# EAGLE design pentajoy_io (EAGLE 5.11)
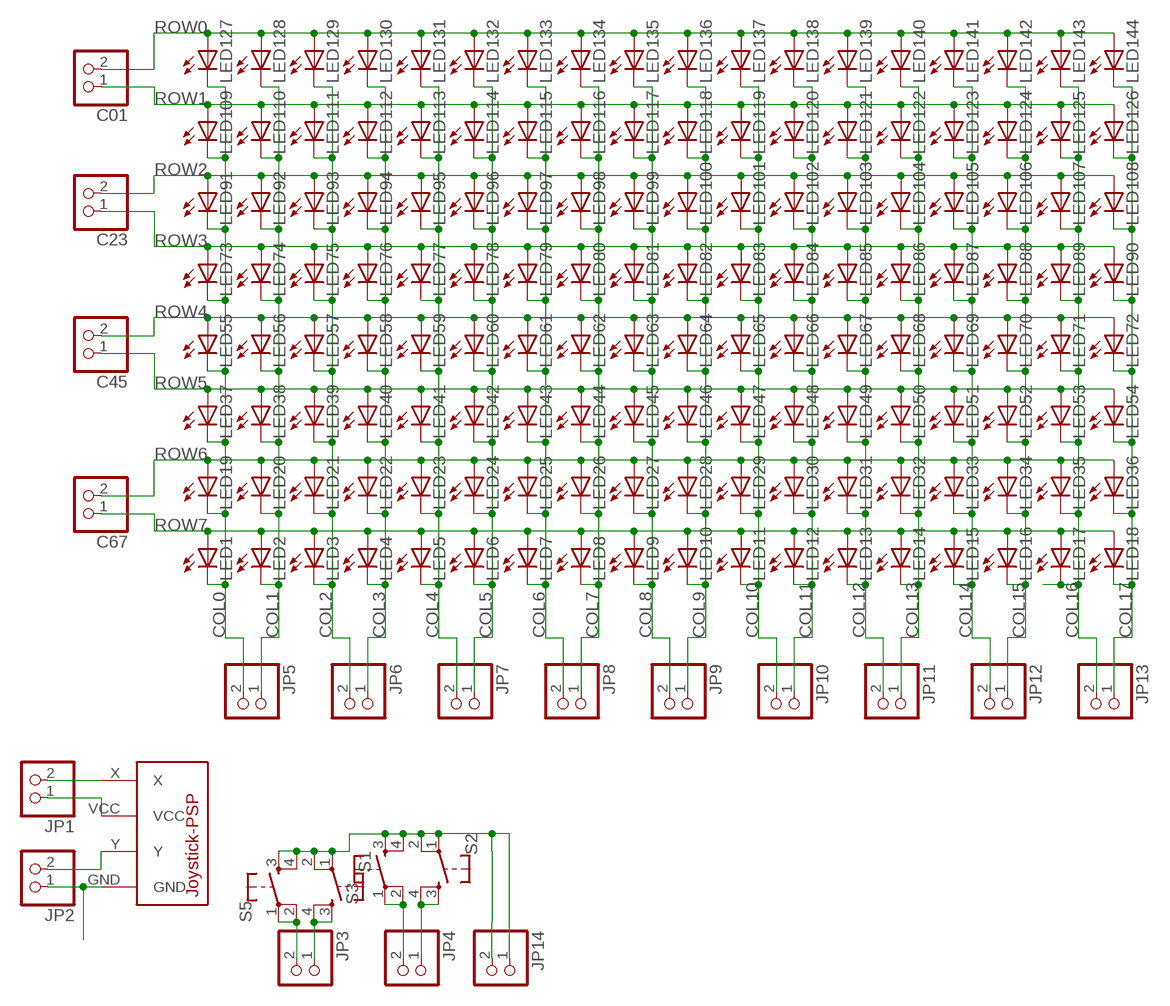
[diagram p0: schematic, sheet 1]

## Parts
C01  PINHD-1X02_2.54-SMD  [1X02SMD]
C23  PINHD-1X02_2.54-SMD  [1X02SMD]
C45  PINHD-1X02_2.54-SMD  [1X02SMD]
C67  PINHD-1X02_2.54-SMD  [1X02SMD]
JP1  PINHD-1X02_2.54-SMD  [1X02SMD]
JP2  PINHD-1X02_2.54-SMD  [1X02SMD]
JP3  PINHD-1X02_2.54-SMD  [1X02SMD]
JP4  PINHD-1X02_2.54-SMD  [1X02SMD]
JP5  PINHD-1X02_2.54-SMD  [1X02SMD]
JP6  PINHD-1X02_2.54-SMD  [1X02SMD]
JP7  PINHD-1X02_2.54-SMD  [1X02SMD]
JP8  PINHD-1X02_2.54-SMD  [1X02SMD]
JP9  PINHD-1X02_2.54-SMD  [1X02SMD]
JP10  PINHD-1X02_2.54-SMD  [1X02SMD]
JP11  PINHD-1X02_2.54-SMD  [1X02SMD]
JP12  PINHD-1X02_2.54-SMD  [1X02SMD]
JP13  PINHD-1X02_2.54-SMD  [1X02SMD]
JP14  PINHD-1X02_2.54-SMD  [1X02SMD]
LED1  LEDCHIPLED_0805  [CHIPLED_0805]
LED2  LEDCHIPLED_0805  [CHIPLED_0805]
LED3  LEDCHIPLED_0805  [CHIPLED_0805]
LED4  LEDCHIPLED_0805  [CHIPLED_0805]
LED5  LEDCHIPLED_0805  [CHIPLED_0805]
LED6  LEDCHIPLED_0805  [CHIPLED_0805]
LED7  LEDCHIPLED_0805  [CHIPLED_0805]
LED8  LEDCHIPLED_0805  [CHIPLED_0805]
LED9  LEDCHIPLED_0805  [CHIPLED_0805]
LED10  LEDCHIPLED_0805  [CHIPLED_0805]
LED11  LEDCHIPLED_0805  [CHIPLED_0805]
LED12  LEDCHIPLED_0805  [CHIPLED_0805]
LED13  LEDCHIPLED_0805  [CHIPLED_0805]
LED14  LEDCHIPLED_0805  [CHIPLED_0805]
LED15  LEDCHIPLED_0805  [CHIPLED_0805]
LED16  LEDCHIPLED_0805  [CHIPLED_0805]
LED17  LEDCHIPLED_0805  [CHIPLED_0805]
LED18  LEDCHIPLED_0805  [CHIPLED_0805]
LED19  LEDCHIPLED_0805  [CHIPLED_0805]
LED20  LEDCHIPLED_0805  [CHIPLED_0805]
LED21  LEDCHIPLED_0805  [CHIPLED_0805]
LED22  LEDCHIPLED_0805  [CHIPLED_0805]
LED23  LEDCHIPLED_0805  [CHIPLED_0805]
LED24  LEDCHIPLED_0805  [CHIPLED_0805]
LED25  LEDCHIPLED_0805  [CHIPLED_0805]
LED26  LEDCHIPLED_0805  [CHIPLED_0805]
LED27  LEDCHIPLED_0805  [CHIPLED_0805]
LED28  LEDCHIPLED_0805  [CHIPLED_0805]
LED29  LEDCHIPLED_0805  [CHIPLED_0805]
LED30  LEDCHIPLED_0805  [CHIPLED_0805]
LED31  LEDCHIPLED_0805  [CHIPLED_0805]
LED32  LEDCHIPLED_0805  [CHIPLED_0805]
LED33  LEDCHIPLED_0805  [CHIPLED_0805]
LED34  LEDCHIPLED_0805  [CHIPLED_0805]
LED35  LEDCHIPLED_0805  [CHIPLED_0805]
LED36  LEDCHIPLED_0805  [CHIPLED_0805]
LED37  LEDCHIPLED_0805  [CHIPLED_0805]
LED38  LEDCHIPLED_0805  [CHIPLED_0805]
LED39  LEDCHIPLED_0805  [CHIPLED_0805]
LED40  LEDCHIPLED_0805  [CHIPLED_0805]
LED41  LEDCHIPLED_0805  [CHIPLED_0805]
LED42  LEDCHIPLED_0805  [CHIPLED_0805]
LED43  LEDCHIPLED_0805  [CHIPLED_0805]
LED44  LEDCHIPLED_0805  [CHIPLED_0805]
LED45  LEDCHIPLED_0805  [CHIPLED_0805]
LED46  LEDCHIPLED_0805  [CHIPLED_0805]
LED47  LEDCHIPLED_0805  [CHIPLED_0805]
LED48  LEDCHIPLED_0805  [CHIPLED_0805]
LED49  LEDCHIPLED_0805  [CHIPLED_0805]
LED50  LEDCHIPLED_0805  [CHIPLED_0805]
LED51  LEDCHIPLED_0805  [CHIPLED_0805]
LED52  LEDCHIPLED_0805  [CHIPLED_0805]
LED53  LEDCHIPLED_0805  [CHIPLED_0805]
LED54  LEDCHIPLED_0805  [CHIPLED_0805]
LED55  LEDCHIPLED_0805  [CHIPLED_0805]
LED56  LEDCHIPLED_0805  [CHIPLED_0805]
LED57  LEDCHIPLED_0805  [CHIPLED_0805]
LED58  LEDCHIPLED_0805  [CHIPLED_0805]
LED59  LEDCHIPLED_0805  [CHIPLED_0805]
LED60  LEDCHIPLED_0805  [CHIPLED_0805]
LED61  LEDCHIPLED_0805  [CHIPLED_0805]
LED62  LEDCHIPLED_0805  [CHIPLED_0805]
LED63  LEDCHIPLED_0805  [CHIPLED_0805]
LED64  LEDCHIPLED_0805  [CHIPLED_0805]
LED65  LEDCHIPLED_0805  [CHIPLED_0805]
LED66  LEDCHIPLED_0805  [CHIPLED_0805]
LED67  LEDCHIPLED_0805  [CHIPLED_0805]
LED68  LEDCHIPLED_0805  [CHIPLED_0805]
LED69  LEDCHIPLED_0805  [CHIPLED_0805]
LED70  LEDCHIPLED_0805  [CHIPLED_0805]
LED71  LEDCHIPLED_0805  [CHIPLED_0805]
LED72  LEDCHIPLED_0805  [CHIPLED_0805]
LED73  LEDCHIPLED_0805  [CHIPLED_0805]
LED74  LEDCHIPLED_0805  [CHIPLED_0805]
LED75  LEDCHIPLED_0805  [CHIPLED_0805]
LED76  LEDCHIPLED_0805  [CHIPLED_0805]
LED77  LEDCHIPLED_0805  [CHIPLED_0805]
LED78  LEDCHIPLED_0805  [CHIPLED_0805]
LED79  LEDCHIPLED_0805  [CHIPLED_0805]
LED80  LEDCHIPLED_0805  [CHIPLED_0805]
LED81  LEDCHIPLED_0805  [CHIPLED_0805]
LED82  LEDCHIPLED_0805  [CHIPLED_0805]
LED83  LEDCHIPLED_0805  [CHIPLED_0805]
LED84  LEDCHIPLED_0805  [CHIPLED_0805]
LED85  LEDCHIPLED_0805  [CHIPLED_0805]
LED86  LEDCHIPLED_0805  [CHIPLED_0805]
LED87  LEDCHIPLED_0805  [CHIPLED_0805]
LED88  LEDCHIPLED_0805  [CHIPLED_0805]
LED89  LEDCHIPLED_0805  [CHIPLED_0805]
LED90  LEDCHIPLED_0805  [CHIPLED_0805]
LED91  LEDCHIPLED_0805  [CHIPLED_0805]
LED92  LEDCHIPLED_0805  [CHIPLED_0805]
LED93  LEDCHIPLED_0805  [CHIPLED_0805]
LED94  LEDCHIPLED_0805  [CHIPLED_0805]
LED95  LEDCHIPLED_0805  [CHIPLED_0805]
LED96  LEDCHIPLED_0805  [CHIPLED_0805]
LED97  LEDCHIPLED_0805  [CHIPLED_0805]
LED98  LEDCHIPLED_0805  [CHIPLED_0805]
LED99  LEDCHIPLED_0805  [CHIPLED_0805]
LED100  LEDCHIPLED_0805  [CHIPLED_0805]
LED101  LEDCHIPLED_0805  [CHIPLED_0805]
LED102  LEDCHIPLED_0805  [CHIPLED_0805]
LED103  LEDCHIPLED_0805  [CHIPLED_0805]
LED104  LEDCHIPLED_0805  [CHIPLED_0805]
LED105  LEDCHIPLED_0805  [CHIPLED_0805]
LED106  LEDCHIPLED_0805  [CHIPLED_0805]
LED107  LEDCHIPLED_0805  [CHIPLED_0805]
LED108  LEDCHIPLED_0805  [CHIPLED_0805]
LED109  LEDCHIPLED_0805  [CHIPLED_0805]
LED110  LEDCHIPLED_0805  [CHIPLED_0805]
LED111  LEDCHIPLED_0805  [CHIPLED_0805]
LED112  LEDCHIPLED_0805  [CHIPLED_0805]
LED113  LEDCHIPLED_0805  [CHIPLED_0805]
LED114  LEDCHIPLED_0805  [CHIPLED_0805]
LED115  LEDCHIPLED_0805  [CHIPLED_0805]
LED116  LEDCHIPLED_0805  [CHIPLED_0805]
LED117  LEDCHIPLED_0805  [CHIPLED_0805]
LED118  LEDCHIPLED_0805  [CHIPLED_0805]
LED119  LEDCHIPLED_0805  [CHIPLED_0805]
LED120  LEDCHIPLED_0805  [CHIPLED_0805]
LED121  LEDCHIPLED_0805  [CHIPLED_0805]
LED122  LEDCHIPLED_0805  [CHIPLED_0805]
LED123  LEDCHIPLED_0805  [CHIPLED_0805]
LED124  LEDCHIPLED_0805  [CHIPLED_0805]
LED125  LEDCHIPLED_0805  [CHIPLED_0805]
LED126  LEDCHIPLED_0805  [CHIPLED_0805]
LED127  LEDCHIPLED_0805  [CHIPLED_0805]
LED128  LEDCHIPLED_0805  [CHIPLED_0805]
LED129  LEDCHIPLED_0805  [CHIPLED_0805]
LED130  LEDCHIPLED_0805  [CHIPLED_0805]
LED131  LEDCHIPLED_0805  [CHIPLED_0805]
LED132  LEDCHIPLED_0805  [CHIPLED_0805]
LED133  LEDCHIPLED_0805  [CHIPLED_0805]
LED134  LEDCHIPLED_0805  [CHIPLED_0805]
LED135  LEDCHIPLED_0805  [CHIPLED_0805]
LED136  LEDCHIPLED_0805  [CHIPLED_0805]
LED137  LEDCHIPLED_0805  [CHIPLED_0805]
LED138  LEDCHIPLED_0805  [CHIPLED_0805]
LED139  LEDCHIPLED_0805  [CHIPLED_0805]
LED140  LEDCHIPLED_0805  [CHIPLED_0805]
LED141  LEDCHIPLED_0805  [CHIPLED_0805]
LED142  LEDCHIPLED_0805  [CHIPLED_0805]
LED143  LEDCHIPLED_0805  [CHIPLED_0805]
LED144  LEDCHIPLED_0805  [CHIPLED_0805]
S1  TAC_SWITCHPTH  [TACTILE-PTH]
S2  TAC_SWITCHPTH  [TACTILE-PTH]
S3  TAC_SWITCHPTH  [TACTILE-PTH]
S5  TAC_SWITCHPTH  [TACTILE-PTH]
U$1  JOYSTICK-PSP1000  [JOYSTICK-PSP1000]

## Nets
COL0: JP5.2 LED1.C LED19.C LED37.C LED55.C LED73.C LED91.C LED109.C LED127.C
COL1: JP5.1 LED2.C LED20.C LED38.C LED56.C LED74.C LED92.C LED110.C LED128.C
COL2: JP6.2 LED3.C LED21.C LED39.C LED57.C LED75.C LED93.C LED111.C LED129.C
COL3: JP6.1 LED4.C LED22.C LED40.C LED58.C LED76.C LED94.C LED112.C LED130.C
COL4: JP7.2 LED5.C LED23.C LED41.C LED59.C LED77.C LED95.C LED113.C LED131.C
COL5: JP7.1 LED6.C LED24.C LED42.C LED60.C LED78.C LED96.C LED114.C LED132.C
COL6: JP8.2 LED7.C LED25.C LED43.C LED61.C LED79.C LED97.C LED115.C LED133.C
COL7: JP8.1 LED8.C LED26.C LED44.C LED62.C LED80.C LED98.C LED116.C LED134.C
COL8: JP9.2 LED9.C LED27.C LED45.C LED63.C LED81.C LED99.C LED117.C LED135.C
COL9: JP9.1 LED10.C LED28.C LED46.C LED64.C LED82.C LED100.C LED118.C LED136.C
COL10: JP10.2 LED11.C LED29.C LED47.C LED65.C LED83.C LED101.C LED119.C LED137.C
COL11: JP10.1 LED12.C LED30.C LED48.C LED66.C LED84.C LED102.C LED120.C LED138.C
COL12: JP11.2 LED13.C LED31.C LED49.C LED67.C LED85.C LED103.C LED121.C LED139.C
COL13: JP11.1 LED14.C LED32.C LED50.C LED68.C LED86.C LED104.C LED122.C LED140.C
COL14: JP12.2 LED15.C LED33.C LED51.C LED69.C LED87.C LED105.C LED123.C LED141.C
COL15: JP12.1 LED16.C LED34.C LED52.C LED70.C LED88.C LED106.C LED124.C LED142.C
COL16: JP13.2 LED17.C LED35.C LED53.C LED71.C LED89.C LED107.C LED125.C LED143.C
COL17: JP13.1 LED18.C LED36.C LED54.C LED72.C LED90.C LED108.C LED126.C LED144.C
GND: JP2.1 JP14.1 JP14.2 S1.1 S1.2 S2.1 S2.2 S3.3 S3.4 S5.3 S5.4 U$1.GND
N$1: JP4.1 S2.3 S2.4
N$2: JP4.2 S3.1 S3.2
N$3: JP3.1 S1.3 S1.4
N$4: JP3.2 S5.1 S5.2
N$6: JP2.2 U$1.Y
N$7: JP1.1 U$1.VCC
N$8: JP1.2 U$1.X
ROW0: C01.2 LED127.A LED128.A LED129.A LED130.A LED131.A LED132.A LED133.A LED134.A LED135.A LED136.A LED137.A LED138.A LED139.A LED140.A LED141.A LED142.A LED143.A LED144.A
ROW1: C01.1 LED109.A LED110.A LED111.A LED112.A LED113.A LED114.A LED115.A LED116.A LED117.A LED118.A LED119.A LED120.A LED121.A LED122.A LED123.A LED124.A LED125.A LED126.A
ROW2: C23.2 LED91.A LED92.A LED93.A LED94.A LED95.A LED96.A LED97.A LED98.A LED99.A LED100.A LED101.A LED102.A LED103.A LED104.A LED105.A LED106.A LED107.A LED108.A
ROW3: C23.1 LED73.A LED74.A LED75.A LED76.A LED77.A LED78.A LED79.A LED80.A LED81.A LED82.A LED83.A LED84.A LED85.A LED86.A LED87.A LED88.A LED89.A LED90.A
ROW4: C45.2 LED55.A LED56.A LED57.A LED58.A LED59.A LED60.A LED61.A LED62.A LED63.A LED64.A LED65.A LED66.A LED67.A LED68.A LED69.A LED70.A LED71.A LED72.A
ROW5: C45.1 LED37.A LED38.A LED39.A LED40.A LED41.A LED42.A LED43.A LED44.A LED45.A LED46.A LED47.A LED48.A LED49.A LED50.A LED51.A LED52.A LED53.A LED54.A
ROW6: C67.2 LED19.A LED20.A LED21.A LED22.A LED23.A LED24.A LED25.A LED26.A LED27.A LED28.A LED29.A LED30.A LED31.A LED32.A LED33.A LED34.A LED35.A LED36.A
ROW7: C67.1 LED1.A LED2.A LED3.A LED4.A LED5.A LED6.A LED7.A LED8.A LED9.A LED10.A LED11.A LED12.A LED13.A LED14.A LED15.A LED16.A LED17.A LED18.A

## Library data of the parts
C01 C23 C45 C67 JP1-JP14 = pinhead-2:PINHD-1X02: PIN HEADER
LED1-LED144 = led:LED: LED OSRAM: - CHIPLED LG R971, LG N971, LY N971, LG Q971, LY Q971, LO R971, LY R971 LH N974, LH R974 LS Q976, LO Q976, LY Q976 LO Q996 - Hyper CHIPLED LW Q18S LB Q993, LB Q99A, LB R99A - SideLED LS A670, LO A670, LY A670, LG A670, LP A670 LB A673, LV A673, LT A673, LW A673 LH A674 LY A675 LS A676, LA A676, LO A676, LY A676, LW A676 LS A679, LY A679, LG A679 - Hyper Micro SIDELED® LS Y876, LA Y876, LO Y876, LY Y876 LT Y87S - SmartLED LW L88C, LW L88S LB L89C, LB L89S, LG L890 LS L89K, LO L89K, LY L89K LS L896, LA L896, LO L896, LY L896 - TOPLED LS T670, LO T670, LY T670, LG T670, LP T670 LSG T670, LSP T670, LSY T670, LOP T670, LYG T670 LG T671, LOG T671, LSG T671 LB T673, LV T673, LT T673, LW T673 LH T674 LS T676, LA T676, LO T676, LY T676, LB T676, LH T676, LSB T676, LW T676 LB T67C, LV T67C, LT T67C, LS T67K, LO T67K, LY T67K, LW E67C LS E67B, LA E67B, LO E67B, LY E67B, LB E67C, LV E67C, LT E67C LW T67C LS T679, LY T679, LG T679 LS T770, LO T770, LY T770, LG T770, LP T770 LB T773, LV T773, LT T773, LW T773 LH T774 LS E675, LA E675, LY E675, LS T675 LS T776, LA T776, LO T776, LY T776, LB T776 LHGB T686 LT T68C, LB T68C - Hyper Mini TOPLED® LB M676 - Mini TOPLED Santana® LG M470 LS M47K, LO M47K, LY M47K Source: http://www.osram.convergy.de LUXEON: - LUMILED® LXK2-PW12-R00, LXK2-PW12-S00, LXK2-PW14-U00, LXK2-PW14-V00 LXK2-PM12-R00, LXK2-PM12-S00, LXK2-PM14-U00 LXK2-PE12-Q00, LXK2-PE12-R00, LXK2-PE12-S00, LXK2-PE14-T00, LXK2-PE14-U00 LXK2-PB12-K00, LXK2-PB12-L00, LXK2-PB12-M00, LXK2-PB14-N00, LXK2-PB14-P00, LXK2-PB14-Q00 LXK2-PR12-L00, LXK2-PR12-M00, LXK2-PR14-Q00, LXK2-PR14-R00 LXK2-PD12-Q00, LXK2-PD12-R00, LXK2-PD12-S00 LXK2-PH12-R00, LXK2-PH12-S00 LXK2-PL12-P00, LXK2-PL12-Q00, LXK2-PL12-R00 Source: www.luxeon.com KINGBRIGHT: KA-3528ASYC Source: www.kingbright.com
S1-S3 S5 = SparkFun:TAC_SWITCH: Momentary Switch Button commonly used for reset or general input. Spark Fun Electronics SKU : COM-00097
U$1 = SparkFun:JOYSTICK-PSP1000: This is a footprint for the PSP-1000 Joystick. 4-pins: X, Y, Vcc and GND

## Board
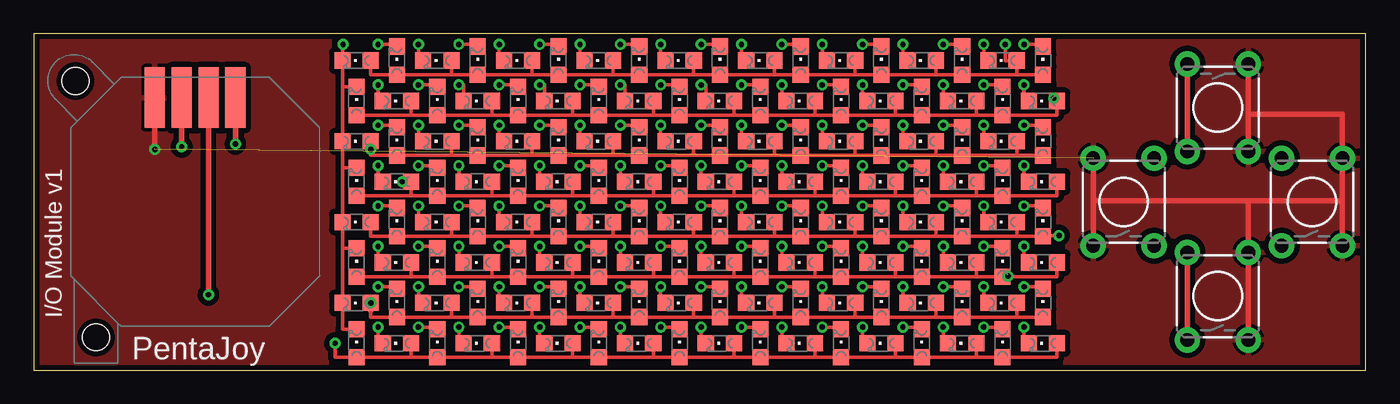
[diagram p1: board, top side]
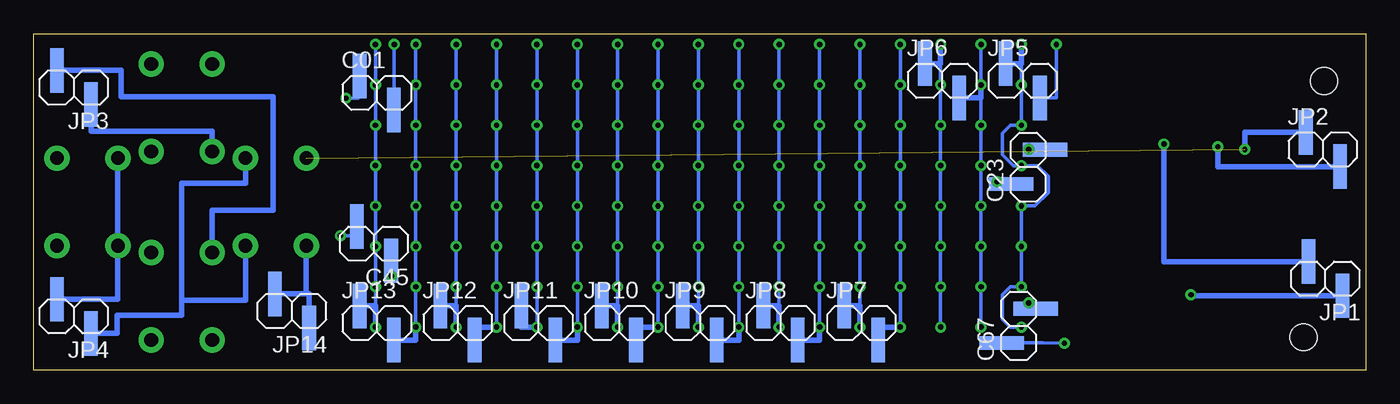
[diagram p2: board, bottom side, seen from below]

Size 99 x 25 mm. Coordinates in mm from the lower left corner, seen from the top.
Outline: 99,25 0,25 0,0 99,0 99,25
Copper layers (1+2*3+16): Top 0.035mm / dielectric 1.5mm / Route2 0.035mm / dielectric 0.15mm / Route3 0.035mm / dielectric 0.2mm / Bottom 0.035mm
Design rules "default *": minimum track width 10mil, minimum drill 0.4mm, track to track 8mil, track to pad 8mil, pad to pad 8mil, via to via 8mil, smd to smd 8mil, copper to edge 15mil, drill to drill 8mil, minimum pad ring 10mil, minimum via ring 8mil, stop-mask expansion 4mil, vias tented up to drill 190mil, thermal gap 10mil

### Footprints (pad centres in the part's own frame; a part is rotated, then mirrored left to right if it is on the bottom)
1X02SMD = smd 1.016 x 3.302: 1 -1.27,1.27; 2 1.27,-1.27
CHIPLED_0805 = smd 1.2 x 1.2: A 0,-1.05; C 0,1.05
TACTILE-PTH = drill 1.016 pad 1.88 round: 1 -3.251,2.261; 2 3.251,2.261; 3 -3.251,-2.261; 4 3.251,-2.261
JOYSTICK-PSP1000 = smd 1.5 x 4.5: GND -3,7.75; VCC 1,7.75; X 3,7.75; Y -1,7.75 | hole 2: -8.89,8.985; -7.375,-10.06

### Placement (x,y rotation side)
C01  73.5,20.6 0 bottom
C23  25.1,15.1 90 bottom
C45  73.7,9.4 180 bottom
C67  25.8,3.3 90 bottom
JP1  3,6.8 180 bottom
JP2  3.2,16.4 0 bottom
JP3  96,21 180 bottom
JP4  96,4 180 bottom
JP5  25.5,21.5 0 bottom
JP6  31.5,21.5 0 bottom
JP7  37.5,3.5 0 bottom
JP8  43.5,3.5 0 bottom
JP9  49.5,3.5 0 bottom
JP10  55.5,3.5 0 bottom
JP11  61.5,3.5 0 bottom
JP12  67.5,3.5 0 bottom
JP13  73.5,3.5 0 bottom
JP14  79.8,4.4 180 bottom
LED1  24,2 0 top
LED2  27,2 90 top
LED3  30,2 0 top
LED4  33,2 90 top
LED5  36,2 0 top
LED6  39,2 90 top
LED7  42,2 0 top
LED8  45,2 90 top
LED9  48,2 0 top
LED10  51,2 90 top
LED11  54,2 0 top
LED12  57,2 90 top
LED13  60,2 0 top
LED14  63,2 90 top
LED15  66,2 0 top
LED16  69,2 90 top
LED17  72,2 0 top
LED18  75,2 90 top
LED19  24,5 90 top
LED20  27,5 0 top
LED21  30,5 90 top
LED22  33,5 0 top
LED23  36,5 90 top
LED24  39,5 0 top
LED25  42,5 90 top
LED26  45,5 0 top
LED27  48,5 90 top
LED28  51,5 0 top
LED29  54,5 90 top
LED30  57,5 0 top
LED31  60,5 90 top
LED32  63,5 0 top
LED33  66,5 90 top
LED34  69,5 0 top
LED35  72,5 90 top
LED36  75,5 0 top
LED37  24,8 0 top
LED38  27,8 90 top
LED39  30,8 0 top
LED40  33,8 90 top
LED41  36,8 0 top
LED42  39,8 90 top
LED43  42,8 0 top
LED44  45,8 90 top
LED45  48,8 0 top
LED46  51,8 90 top
LED47  54,8 0 top
LED48  57,8 90 top
LED49  60,8 0 top
LED50  63,8 90 top
LED51  66,8 0 top
LED52  69,8 90 top
LED53  72,8 0 top
LED54  75,8 90 top
LED55  24,11 90 top
LED56  27,11 0 top
LED57  30,11 90 top
LED58  33,11 0 top
LED59  36,11 90 top
LED60  39,11 0 top
LED61  42,11 90 top
LED62  45,11 0 top
LED63  48,11 90 top
LED64  51,11 0 top
LED65  54,11 90 top
LED66  57,11 0 top
LED67  60,11 90 top
LED68  63,11 0 top
LED69  66,11 90 top
LED70  69,11 0 top
LED71  72,11 90 top
LED72  75,11 0 top
LED73  24,14 0 top
LED74  27,14 90 top
LED75  30,14 0 top
LED76  33,14 90 top
LED77  36,14 0 top
LED78  39,14 90 top
LED79  42,14 0 top
LED80  45,14 90 top
LED81  48,14 0 top
LED82  51,14 90 top
LED83  54,14 0 top
LED84  57,14 90 top
LED85  60,14 0 top
LED86  63,14 90 top
LED87  66,14 0 top
LED88  69,14 90 top
LED89  72,14 0 top
LED90  75,14 90 top
LED91  24,17 90 top
LED92  27,17 0 top
LED93  30,17 90 top
LED94  33,17 0 top
LED95  36,17 90 top
LED96  39,17 0 top
LED97  42,17 90 top
LED98  45,17 0 top
LED99  48,17 90 top
LED100  51,17 0 top
LED101  54,17 90 top
LED102  57,17 0 top
LED103  60,17 90 top
LED104  63,17 0 top
LED105  66,17 90 top
LED106  69,17 0 top
LED107  72,17 90 top
LED108  75,17 0 top
LED109  24,20 0 top
LED110  27,20 90 top
LED111  30,20 0 top
LED112  33,20 90 top
LED113  36,20 0 top
LED114  39,20 90 top
LED115  42,20 0 top
LED116  45,20 90 top
LED117  48,20 0 top
LED118  51,20 90 top
LED119  54,20 0 top
LED120  57,20 90 top
LED121  60,20 0 top
LED122  63,20 90 top
LED123  66,20 0 top
LED124  69,20 90 top
LED125  72,20 0 top
LED126  75,20 90 top
LED127  24,23 90 top
LED128  27,23 0 top
LED129  30,23 90 top
LED130  33,23 0 top
LED131  36,23 90 top
LED132  39,23 0 top
LED133  42,23 90 top
LED134  45,23 0 top
LED135  48,23 90 top
LED136  51,23 0 top
LED137  54,23 90 top
LED138  57,23 0 top
LED139  60,23 90 top
LED140  63,23 0 top
LED141  66,23 90 top
LED142  69,23 0 top
LED143  72,23 90 top
LED144  75,23 0 top
S1  88,19.5 270 top
S2  81,12.5 90 top
S3  95,12.5 90 top
S5  88,5.5 90 top
U$1  12,12.5 0 top

### Tracks (layer width: path | path; a pad name or v marks a point on that pad's centre or on a via)
COL0  (via drill 0.4)
  Top 0.254: LED1.C 22.95,3.05 LED19.C 22.95,9.05 | 22.95,9.05 LED37.C | 22.95,9.05 LED55.C 22.95,15 | 22.95,15 LED91.C 22.95,21 | 22.95,21 LED127.C 22.95,24.2 v23,24.2 | LED73.C 22.95,15.05 22.95,15 | LED109.C 22.95,21.05 22.95,21
  Bottom 0.254: JP5.2 23,20.23 v23,24.2
COL1  (via drill 0.4)
  Top 0.254: LED2.C 25.6,2 v25.6,3.2 | v25.6,9.2 25.6,8 LED38.C | LED20.C 27,6.2 v25.6,6.2 | v25.6,24.2 27,24.2 LED128.C | LED56.C 27,12.2 v25.6,12.2 | LED74.C 25.6,14 v25.6,15.2 | LED92.C 27,18.2 v25.6,18.2 | LED110.C 25.6,20 v25.6,21.2
  Bottom 0.254: v25.6,6.2 25.6,6.8 | 25.6,6.8 v25.6,9.2 v25.6,12.2 24.6,12.2 23.6,13.2 23.6,14.4 24.4,15.2 v25.6,15.2 26.2,15.2 27,16 27,17.6 26.4,18.2 v25.6,18.2 v25.6,21.2 | v25.6,6.2 25.6,6.8 | v25.6,21.2 25.6,21.4 | 25.6,21.4 v25.6,24.2 | v25.6,21.2 25.6,21.4 | v25.6,3.2 26.4,3.2 27,3.8 27,5.6 26.4,6.2 v25.6,6.2
  Bottom 0.406: JP5.1 25.6,22.77 v25.6,24.2
COL2  (via drill 0.4)
  Top 0.254: LED3.C 30,3.2 v28.6,3.2 | v28.6,24.2 28.6,23 LED129.C | v28.6,21.2 30,21.2 LED111.C | LED93.C 28.6,17 v28.6,18.2 | LED57.C 28.6,11 v28.6,12.2 | v28.6,15.2 30,15.2 LED75.C | v28.6,9.2 30,9.2 LED39.C | LED21.C 28.6,5 v28.6,6.2
  Bottom 0.254: v28.6,24.2 v28.6,21.2 v28.6,18.2 v28.6,15.2 v28.6,12.2 v28.6,9.2 v28.6,6.2 v28.6,3.2
  Bottom 0.406: JP6.2 28.6,20.23 v28.6,21.2
COL3  (via drill 0.4)
  Top 0.254: LED4.C 31.6,2 v31.6,3.2 | v31.6,24.2 33,24.2 LED130.C | v31.6,21.2 31.95,21.2 LED112.C | v31.6,18.2 33,18.2 LED94.C | v31.6,6.2 33,6.2 LED22.C | v31.6,12.2 33,12.2 LED58.C | LED40.C 31.6,8 v31.6,9.2 | LED76.C 31.6,14 v31.6,15.2
  Bottom 0.254: v31.6,24.2 v31.6,21.2 v31.6,18.2 v31.6,15.2 v31.6,12.2 v31.6,9.2 v31.6,6.2 v31.6,3.2
  Bottom 0.406: JP6.1 31.6,22.77 v31.6,24.2
COL4  (via drill 0.4)
  Top 0.254: LED5.C 36,3.2 v34.6,3.2 | v34.6,24.2 34.6,23 LED131.C | v34.6,21.2 36,21.2 LED113.C | v34.6,15.2 36,15.2 LED77.C | v34.6,9.2 36,9.2 LED41.C | LED95.C 34.6,17 v34.6,18.2 | LED23.C 34.6,5 v34.6,6.2 | LED59.C 34.6,11 v34.6,12.2
  Bottom 0.254: v34.6,24.2 v34.6,21.2 v34.6,18.2 v34.6,15.2 v34.6,12.2 v34.6,9.2 v34.6,6.2 v34.6,3.2
  Bottom 0.406: v34.6,3.2 36.23,3.2 JP7.2
COL5  (via drill 0.4)
  Top 0.254: LED6.C 37.6,2 v37.6,3.2 | v37.6,24.2 39,24.2 LED132.C | v37.6,21.2 37.95,21.2 LED114.C | v37.6,18.2 39,18.2 LED96.C | v37.6,12.2 39,12.2 LED60.C | v37.6,6.2 39,6.2 LED24.C | LED78.C 37.6,14 v37.6,15.2 | LED42.C 37.6,8 v37.6,9.2
  Bottom 0.254: v37.6,24.2 v37.6,21.2 v37.6,18.2 v37.6,15.2 v37.6,12.2 v37.6,9.2 v37.6,6.2 v37.6,3.2
  Bottom 0.406: JP7.1 37.6,4.77 v37.6,3.2
COL6  (via drill 0.4)
  Top 0.254: LED7.C 42,3.2 v40.6,3.2 | v40.6,24.2 40.6,23 LED133.C | v40.6,21.2 42,21.2 LED115.C | LED97.C 40.6,17 v40.6,18.2 | v40.6,15.2 42,15.2 LED79.C | LED25.C 40.6,5 v40.6,6.2 | v40.6,9.2 42,9.2 LED43.C | LED61.C 40.6,11 v40.6,12.2
  Bottom 0.254: v40.6,24.2 v40.6,21.2 v40.6,18.2 v40.6,15.2 v40.6,12.2 v40.6,9.2 v40.6,6.2 v40.6,3.2
  Bottom 0.406: JP8.2 40.6,2.23 v40.6,3.2
COL7  (via drill 0.4)
  Top 0.254: LED8.C 43.6,2 v43.6,3.2 | v43.6,24.2 45,24.2 LED134.C | v43.6,21.2 43.95,21.2 LED116.C | v43.6,18.2 45,18.2 LED98.C | v43.6,12.2 45,12.2 LED62.C | v43.6,6.2 45,6.2 LED26.C | LED44.C 43.6,8 v43.6,9.2 | LED80.C 43.6,14 v43.6,15.2
  Bottom 0.254: v43.6,24.2 v43.6,21.2 v43.6,18.2 v43.6,15.2 v43.6,12.2 v43.6,9.2 v43.6,6.2 v43.6,3.2
  Bottom 0.406: JP8.1 43.6,4.77 v43.6,3.2
COL8  (via drill 0.4)
  Top 0.254: LED9.C 48,3.2 v46.6,3.2 | v46.6,24.2 46.6,23 LED135.C | v46.6,21.2 48,21.2 LED117.C | LED27.C 46.6,5 v46.6,6.2 | v46.6,9.2 48,9.2 LED45.C | LED63.C 46.6,11 v46.6,12.2 | v46.6,15.2 48,15.2 LED81.C | LED99.C 46.6,17 v46.6,18.2
  Bottom 0.254: v46.6,24.2 v46.6,21.2 v46.6,18.2 v46.6,15.2 v46.6,12.2 v46.6,9.2 v46.6,6.2 v46.6,3.2
  Bottom 0.406: JP9.2 46.6,2.23 v46.6,3.2
COL9  (via drill 0.4)
  Top 0.254: LED10.C 49.6,2 v49.6,3.2 | v49.6,24.2 51,24.2 LED136.C | v49.6,21.2 49.95,21.2 LED118.C | v49.6,18.2 51,18.2 LED100.C | LED46.C 49.6,8 v49.6,9.2 | v49.6,12.2 51,12.2 LED64.C | LED82.C 49.6,14 v49.6,15.2 | v49.6,6.2 51,6.2 LED28.C
  Bottom 0.254: v49.6,24.2 v49.6,21.2 v49.6,18.2 v49.6,15.2 v49.6,12.2 v49.6,9.2 v49.6,6.2 v49.6,3.2
  Bottom 0.406: JP9.1 49.6,4.77 v49.6,3.2
COL10  (via drill 0.4)
  Top 0.254: LED11.C 54,3.2 v52.6,3.2 | v52.6,24.2 52.6,23 LED137.C | v52.6,21.2 54,21.2 LED119.C | v52.6,15.2 54,15.2 LED83.C | LED29.C 52.6,5 v52.6,6.2 | v52.6,9.2 54,9.2 LED47.C | LED65.C 52.6,11 v52.6,12.2 | LED101.C 52.6,17 v52.6,18.2
  Bottom 0.254: v52.6,24.2 v52.6,21.2 v52.6,18.2 v52.6,15.2 v52.6,12.2 v52.6,9.2 v52.6,6.2 v52.6,3.2
  Bottom 0.406: v52.6,3.2 54.23,3.2 JP10.2
COL11  (via drill 0.4)
  Top 0.254: LED12.C 55.6,2 v55.6,3.2 | v55.6,24.2 57,24.2 LED138.C | v55.6,6.2 57,6.2 LED30.C | v55.6,18.2 57,18.2 LED102.C | 57,12.5 LED66.C 57,12.2 v55.6,12.2 | LED48.C 55.6,8 v55.6,9.2 | LED84.C 55.6,14 v55.6,15.2 | LED120.C 55.6,20 v55.6,21.2
  Bottom 0.254: v55.6,3.2 v55.6,6.2 v55.6,9.2 v55.6,12.2 v55.6,15.2 v55.6,18.2 v55.6,21.2 v55.6,24.2
  Bottom 0.406: JP10.1 55.6,4.77 v55.6,3.2
COL12  (via drill 0.4)
  Top 0.254: LED13.C 60,3.2 v58.6,3.2 | v58.6,24.2 58.6,23 LED139.C | v58.6,9.2 60,9.2 LED49.C | v58.6,15.2 60,15.2 LED85.C | LED31.C 58.6,5 v58.6,6.2 | LED67.C 58.6,11 v58.6,12.2 | LED103.C 58.6,17 v58.6,18.2 | v58.6,21.2 60,21.2 LED121.C
  Bottom 0.254: v58.6,3.2 v58.6,6.2 v58.6,9.2 v58.6,12.2 v58.6,15.2 v58.6,18.2 v58.6,21.2 v58.6,24.2
  Bottom 0.406: JP11.2 58.6,2.23 v58.6,3.2
COL13  (via drill 0.4)
  Top 0.254: LED14.C 61.6,2 v61.6,3.2 | v61.6,24.2 63,24.2 LED140.C | v61.6,18.2 63,18.2 LED104.C | v61.6,6.2 63,6.2 LED32.C | v61.6,12.2 63,12.2 LED68.C | LED50.C 61.6,8 v61.6,9.2 | LED86.C 61.6,14 v61.6,15.2 | LED122.C 61.6,20 v61.6,21.2
  Bottom 0.254: v61.6,3.2 v61.6,6.2 v61.6,9.2 v61.6,12.2 v61.6,15.2 v61.6,18.2 v61.6,21.2 v61.6,24.2
  Bottom 0.406: v61.6,3.2 62.77,3.2 JP11.1
COL14  (via drill 0.4)
  Top 0.254: LED15.C 66,3.2 v64.6,3.2 | v64.6,24.2 64.6,23 LED141.C | v64.6,9.2 66,9.2 LED51.C | v64.6,15.2 66,15.2 LED87.C | LED33.C 64.6,5 v64.6,6.2 | LED69.C 64.6,11 v64.6,12.2 | LED105.C 64.6,17 v64.6,18.2 | v64.6,21.2 66,21.2 LED123.C
  Bottom 0.254: v64.6,3.2 v64.6,6.2 v64.6,9.2 v64.6,12.2 v64.6,15.2 v64.6,18.2 v64.6,21.2 v64.6,24.2
  Bottom 0.406: v64.6,3.2 66.23,3.2 JP12.2
COL15  (via drill 0.4)
  Top 0.254: LED16.C 67.6,2 v67.6,3.2 | v67.6,24.2 69,24.2 LED142.C | v67.6,18.2 69,18.2 LED106.C | v67.6,6.2 69,6.2 LED34.C | v67.6,12.2 69,12.2 LED70.C | LED52.C 67.6,8 v67.6,9.2 | LED88.C 67.6,14 v67.6,15.2 | LED124.C 67.6,20 v67.6,21.2
  Bottom 0.254: v67.6,3.2 v67.6,6.2 v67.6,9.2 v67.6,12.2 v67.6,15.2 v67.6,18.2 v67.6,21.2 v67.6,24.2
  Bottom 0.406: JP12.1 67.6,4.77 v67.6,3.2
COL16  (via drill 0.4)
  Top 0.254: LED17.C 72,3.2 v70.6,3.2 | v70.6,24.2 70.6,23 LED143.C | v70.6,9.2 72,9.2 LED53.C | v70.6,15.2 72,15.2 LED89.C | LED35.C 70.6,5 v70.6,6.2 | LED71.C 70.6,11 v70.6,12.2 | LED107.C 70.6,17 v70.6,18.2 | v70.6,21.2 72,21.2 LED125.C
  Bottom 0.254: v70.6,3.2 v70.6,6.2 v70.6,9.2 v70.6,12.2 v70.6,15.2 v70.6,18.2 v70.6,21.2 v70.6,24.2
  Bottom 0.406: JP13.2 70.6,2.23 v70.6,3.2
COL17  (via drill 0.4)
  Top 0.254: LED18.C 73.6,2 v73.6,3.2 | v73.6,24.2 75,24.2 LED144.C | v73.6,18.2 75,18.2 LED108.C | v73.6,6.2 75,6.2 LED36.C | v73.6,12.2 75,12.2 LED72.C | LED54.C 73.6,8 v73.6,9.2 | LED90.C 73.6,14 v73.6,15.2 | LED126.C 73.6,20 v73.6,21.2
  Bottom 0.254: v73.6,3.2 v73.6,6.2 v73.6,9.2 v73.6,12.2 v73.6,15.2 v73.6,18.2 v73.6,21.2 v73.6,24.2
  Bottom 0.406: JP13.1 73.6,4.77 v73.6,3.2
GND  (via drill 0.4)  (1 unrouted)
  Top 0.406: 90.26,19 S1.2 | 90.26,19 S1.1 | 90.26,19 97.26,19 S3.4 97.26,12.6 | 97.26,12.6 S3.3 | 90.26,12.6 S5.4 S5.3 | 90.26,12.6 97.26,12.6 | S2.1 78.74,12.1 | 78.74,12.1 78.74,12.6 90.26,12.6 | 78.74,12.1 S2.2 | v9,16.4 U$1.GND
  Bottom 0.406: 78.53,2.74 JP14.1 78.53,5.67 79.1,5.67 | S2.1 78.74,5.67 79.1,5.67 | 79.1,5.67 JP14.2 | JP2.1 9,17.67 v9,16.4
  pour Top (isolate 0.4): 99,0 76.2,0 76.2,25.1 99,25.1
  pour Top (isolate 0.4): 22.8,-0.1 0,-0.1 0,25 22.8,25
N$1
  Bottom 0.406: JP4.1 92.8,2.73 92.8,4.1 88,4.1 88,5.2 | S2.4 83.26,13.9 88,13.9 88,5.2 | 88,5.2 83.9,5.2 83.26,5.2 S2.3
N$2
  Bottom 0.406: JP4.2 92.74,5.27 S3.1 S3.2
N$3
  Top 0.406: S1.4 S1.3
  Bottom 0.406: JP3.1 94.73,17.74 85.74,17.74 S1.4
N$4
  Top 0.406: S5.1 S5.2
  Bottom 0.406: JP3.2 92.5,22.27 92.5,20.3 81.2,20.3 81.2,11.9 85.74,11.9 S5.2
N$6  (via drill 0.4)
  Top 0.406: v11,16.6 U$1.Y
  Bottom 0.406: JP2.2 11,15.13 v11,16.6
N$7  (via drill 0.4)
  Top 0.406: v13,5.6 U$1.VCC
  Bottom 0.406: JP1.1 13,5.53 v13,5.6
N$8  (via drill 0.4)
  Top 0.406: v15,16.8 U$1.X
  Bottom 0.406: JP1.2 15,8.07 v15,16.8
ROW0  (via drill 0.4)
  Top 0.254: 31,21.95 LED128.A 25.05,21.95 LED127.A | 31,21.95 LED130.A 37.4,21.95 | 37.4,21.95 LED132.A LED134.A | LED134.A 49.8,21.95 | 49.8,21.95 LED136.A 55.4,21.95 | 55.4,21.95 LED138.A 61.4,21.95 | 61.4,21.95 LED140.A 67,21.95 | 67,21.95 LED142.A 73.2,21.95 | 73.2,21.95 LED144.A | LED129.A 31.05,21.95 31,21.95 | LED131.A 37.05,21.95 37.4,21.95 | LED133.A 43.05,21.95 LED134.A | LED135.A 49.05,21.95 49.8,21.95 | LED137.A 55.05,21.95 55.4,21.95 | LED139.A 61.05,21.95 61.4,21.95 | LED141.A 67.05,21.95 67,21.95 | 73.2,21.95 73.05,21.95 LED143.A 72.2,23 v72.2,24.2
  Bottom 0.254: v72.2,24.2 72.2,22.77 C01.2
ROW1  (via drill 0.4)
  Top 0.254: LED109.A 29,18.95 | 29,18.95 LED111.A 34.2,18.95 | 34.2,18.95 LED113.A 40.4,18.95 | 40.4,18.95 LED115.A 46.4,18.95 | 46.4,18.95 LED117.A 52.4,18.95 | 52.4,18.95 LED119.A 58.4,18.95 | 58.4,18.95 LED121.A 64.2,18.95 | 64.2,18.95 LED123.A 70.4,18.95 | 70.4,18.95 LED125.A 76.05,18.95 LED126.A 76.4,20 v75.8,20.2 | LED124.A 70.05,18.95 70.4,18.95 | LED122.A 64.05,18.95 64.2,18.95 | LED120.A 58.05,18.95 58.4,18.95 | LED118.A 52.05,18.95 52.4,18.95 | LED116.A 46.05,18.95 46.4,18.95 | LED114.A 40.05,18.95 40.4,18.95 | LED112.A 34.05,18.95 34.2,18.95 | LED110.A 28.05,18.95 29,18.95
  Bottom 0.254: v75.8,20.2 74.87,20.2 C01.1
ROW2  (via drill 0.4)
  Top 0.254: 27.6,15.95 LED92.A | 27.6,15.95 31.2,15.95 | 31.2,15.95 LED94.A 37.6,15.95 | 37.6,15.95 LED96.A 43.4,15.95 | 43.4,15.95 LED98.A 49.2,15.95 | 49.2,15.95 LED100.A 55.2,15.95 | 55.2,15.95 LED102.A 61.4,15.95 | 61.4,15.95 LED104.A 67.4,15.95 | 67.4,15.95 LED106.A 73.2,15.95 | 73.2,15.95 LED108.A | v25.05,16.4 25.05,15.95 27.6,15.95 | v25.05,16.4 LED91.A v25.05,16.4 | LED93.A 31.05,15.95 31.2,15.95 | LED95.A 37.05,15.95 37.6,15.95 | LED97.A 43.05,15.95 43.4,15.95 | LED99.A 49.05,15.95 49.2,15.95 | LED101.A 55.05,15.95 55.2,15.95 | LED103.A 61.05,15.95 61.4,15.95 | LED105.A 67.05,15.95 67.4,15.95 | LED107.A 73.05,15.95 73.2,15.95
  Bottom 0.254: C23.2 25.02,16.37 v25.05,16.4
ROW3  (via drill 0.4)
  Top 0.254: 34.2,12.95 LED75.A 28.4,12.95 | 34.2,12.95 LED77.A 40.4,12.95 | 40.4,12.95 LED79.A 46.2,12.95 | 46.2,12.95 LED81.A 52.2,12.95 | 52.2,12.95 LED83.A 58.4,12.95 | 58.4,12.95 LED85.A 64,12.95 | 64,12.95 LED87.A 70.4,12.95 | 70.4,12.95 LED89.A 76.05,12.95 LED90.A | LED73.A 28.4,12.95 | LED88.A 70.05,12.95 70.4,12.95 | LED86.A 64.05,12.95 64,12.95 | LED84.A 58.05,12.95 58.4,12.95 | LED82.A 52.05,12.95 52.2,12.95 | LED80.A 46.05,12.95 46.2,12.95 | LED78.A 40.05,12.95 40.4,12.95 | LED76.A 34.05,12.95 34.2,12.95 | 28.4,12.95 28.05,12.95 LED74.A v27.4,14
  Bottom 0.254: C23.1 27.23,13.83 v27.4,14
ROW4  (via drill 0.4)
  Top 0.254: 31.2,9.95 LED56.A 25.05,9.95 LED55.A | 31.2,9.95 LED58.A 38,9.95 | 38,9.95 LED60.A 43.6,9.95 | 43.6,9.95 LED62.A 49.2,9.95 | 49.2,9.95 LED64.A LED66.A | LED66.A LED68.A | LED68.A 67.2,9.95 | 67.2,9.95 LED70.A 74,9.95 | 74,9.95 LED72.A 75,10 v76.2,10 | LED57.A 31.05,9.95 31.2,9.95 | LED59.A 37.05,9.95 38,9.95 | LED61.A 43.05,9.95 43.6,9.95 | LED63.A 49.05,9.95 49.2,9.95 | LED65.A 55.05,9.95 LED66.A | LED67.A 61.05,9.95 LED68.A | LED69.A 67.05,9.95 67.2,9.95 | LED71.A 73.05,9.95 74,9.95
  Bottom 0.254: C45.2 75,9.97 v76.2,10
ROW5  (via drill 0.4)
  Top 0.254: LED37.A LED39.A | LED39.A LED41.A | LED40.A 34.05,6.95 LED41.A | LED38.A 28.05,6.95 LED39.A | LED41.A 40.2,6.95 | 40.2,6.95 LED43.A 46.4,6.95 | 46.4,6.95 LED45.A 52.4,6.95 | 52.4,6.95 LED47.A 58.2,6.95 | 58.2,6.95 LED49.A 64.2,6.95 | 64.2,6.95 LED51.A 71.2,6.95 | 71.2,6.95 LED53.A | LED52.A 70.05,6.95 71.2,6.95 | LED50.A 64.05,6.95 64.2,6.95 | LED48.A 58.05,6.95 58.2,6.95 | LED46.A 52.05,6.95 52.4,6.95 | LED44.A 46.05,6.95 46.4,6.95 | LED42.A 40.05,6.95 40.2,6.95 | LED54.A 76.05,6.95 LED53.A | LED53.A 72,6.99 v72.4,6.99
  Bottom 0.254: v72.4,6.99 C45.1 72.4,8.13 v72.4,6.99 | v72.4,6.99 72.4,6.83
ROW6  (via drill 0.4)
  Top 0.254: LED34.A 73.05,3.95 | 73.05,3.95 LED36.A 73.05,3.95 | LED32.A LED34.A | LED30.A LED32.A | LED28.A LED30.A | LED26.A LED28.A | LED26.A LED24.A 38,3.95 | LED22.A 38,3.95 | LED22.A LED20.A 25.05,3.95 25.05,4.4 LED19.A | LED21.A 31.05,3.95 LED22.A | LED25.A 43.05,3.95 LED26.A | LED27.A 49.05,3.95 LED28.A | LED29.A 55.05,3.95 LED30.A | LED31.A 61.05,3.95 LED32.A | LED33.A 67.05,3.95 LED34.A | 73.05,3.95 LED35.A | LED23.A 37.05,3.95 38,3.95
  Top 0.406: LED19.A 25.05,4.4
  Bottom 0.406: C67.2 25.05,4.57 LED19.A
  other vias: 25.05,5
ROW7  (via drill 0.4)
  Top 0.254: LED1.A 22.4,0.95 | 22.4,0.95 28.05,0.95 | 28.05,0.95 LED3.A 33,0.95 | 33,0.95 LED5.A 39,0.95 | 39,0.95 LED7.A 45,0.95 | 45,0.95 LED9.A 51,0.95 | 51,0.95 LED11.A 57,0.95 | 57,0.95 LED13.A 63,0.95 | 63,0.95 LED15.A 69,0.95 | 69,0.95 LED17.A 76.05,0.95 LED18.A | LED16.A 70.05,0.95 69,0.95 | LED14.A 64.05,0.95 63,0.95 | LED12.A 58.05,0.95 57,0.95 | LED10.A 52.05,0.95 51,0.95 | LED8.A 46.05,0.95 45,0.95 | LED6.A 40.05,0.95 39,0.95 | LED4.A 34.05,0.95 33,0.95 | 28.05,0.95 LED2.A | 22.4,0.95 28.05,0.95 | 22.4,0.95 v22.4,2
  Bottom 0.254: C67.1 24,2.03 v22.4,2

### Text on the board
tPlace: I/O Module v1 | PentaJoy